# Altium schematic sheet BSPD+SDC.SchDoc (part 3 of 3)
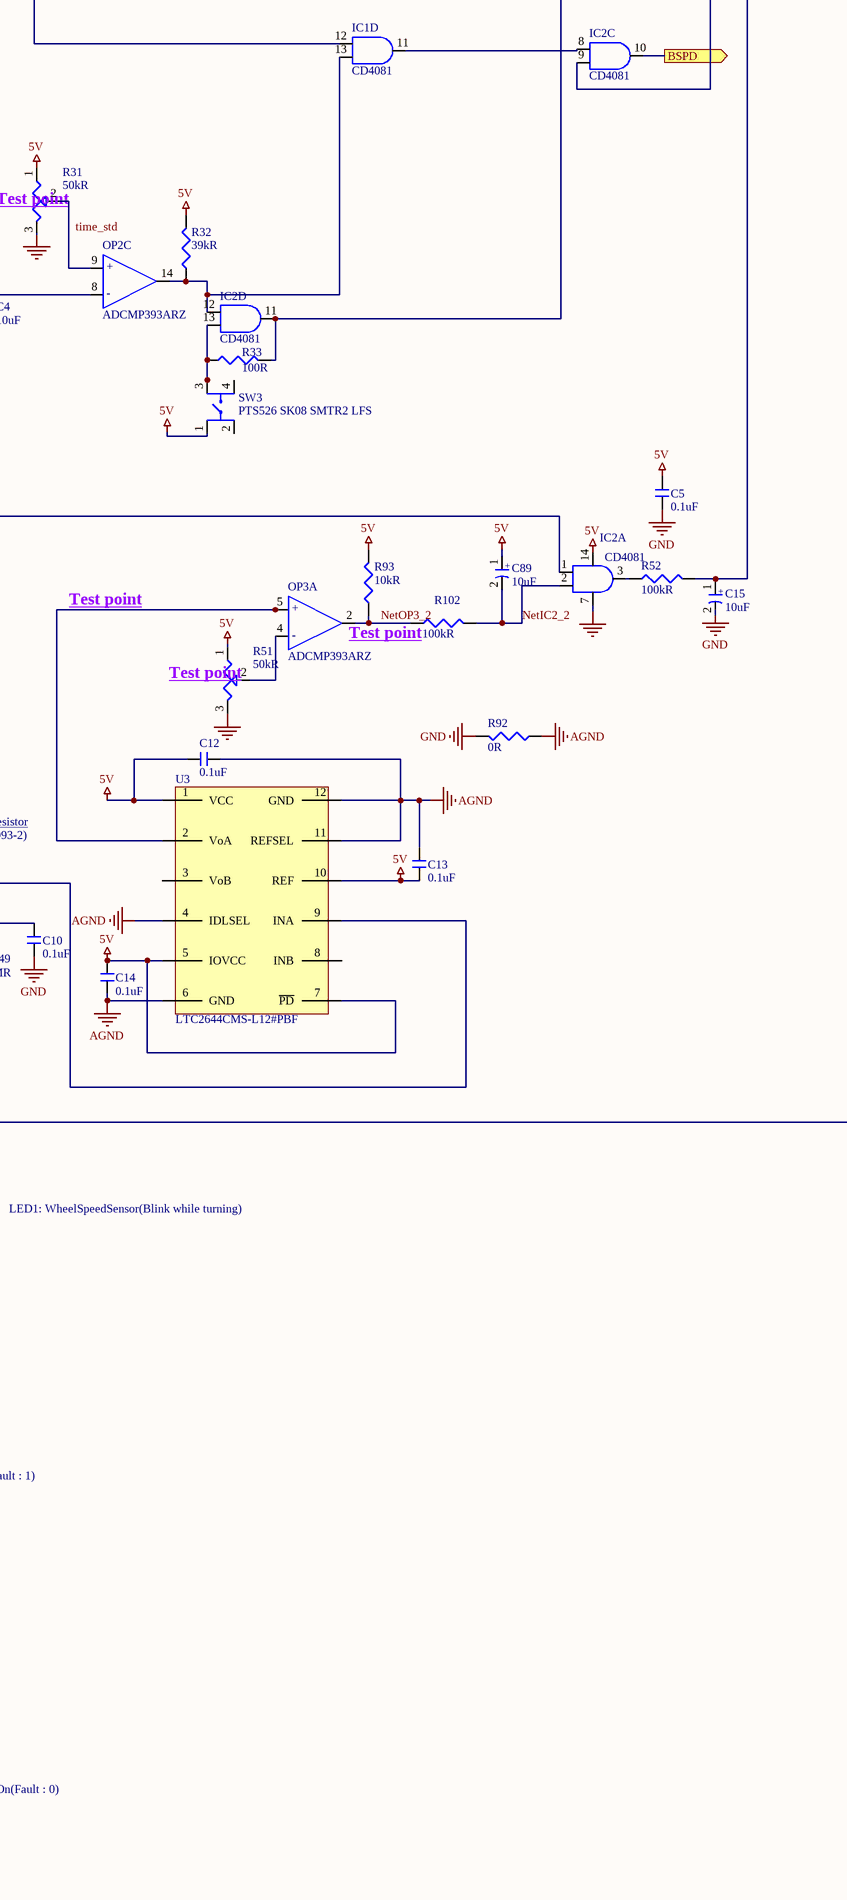
[diagram p5: BSPD+SDC.SchDoc, bottom right]

## Library data of the parts (continued)
OP1-OP4 = ADCMP393ARZ: Comparator Quad R-R I/P 5.5V 14-Pin TSSOP Tube; Manufacturer: Analog Devices; Manufacturer Part Number: ADCMP393ARUZ; Voltage Gain: 132dB; Min Supply Voltage: 2.3V; Number of Elements: 4; Input Offset Voltage (Vos): 500uV; Input Bias Current: 30nA; Quiescent Current: 36.8uA; Propagation Delay: 4.2us; Hysteresis: 4mV; Common Mode Rejection Ratio: 74dB; Power Supply Rejection Ratio (PSRR): 80dB; Supplier 1: Mouser; Supplier Part Number 1: 584-ADCMP393ARZ; Mount: Surface Mount; Case/Package: TSSOP; Number of Pins: 14; Contact Plating: Tin; Min Operating Temperature: -40°C; Max Operating Temperature: 125°C; Packaging: Rail/Tube; Max Supply Voltage: 5.5V; Type: General Purpose; Operating Supply Current: 36.8uA; Lead Free: Contains Lead; RoHS Compliant: Yes; ComponentLink1URL: https://datasheet.ciiva.com/48678/adcmp393-48678181.pdf?src-supplier=Avnet; ComponentLink1Description: https://datasheet.ciiva.com/48678/adcmp393-48678181.pdf?src-supplier=Avnet; ComponentLink2URL: http://datasheet.octopart.com/ADCMP393ARUZ-Analog-Devices-datasheet-27207877.pdf?src-supplier=Analog+Devices; ComponentLink2Description: http://datasheet.octopart.com/ADCMP393ARUZ-Analog-Devices-datasheet-27207877.pdf?src-supplier=Analog+Devices; ComponentLink3URL: http://datasheet.octopart.com/ADCMP393ARUZ-Analog-Devices-datasheet-38899545.pdf?src-supplier=Analog+Devices; ComponentLink3Description: http://datasheet.octopart.com/ADCMP393ARUZ-Analog-Devices-datasheet-38899545.pdf?src-supplier=Analog+Devices; ComponentLink4URL: http://datasheet.octopart.com/ADCMP393ARUZ-Analog-Devices-datasheet-62311843.pdf?src-supplier=Farnell; ComponentLink4Description: http://datasheet.octopart.com/ADCMP393ARUZ-Analog-Devices-datasheet-62311843.pdf?src-supplier=Farnell; ComponentLink5URL: http://datasheet.octopart.com/ADCMP393ARUZ-Analog-Devices-datasheet-78864183.pdf?src-supplier=Farnell; ComponentLink5Description: http://datasheet.octopart.com/ADCMP393ARUZ-Analog-Devices-datasheet-78864183.pdf?src-supplier=Farnell; ComponentLink6URL: http://datasheet.octopart.com/ADCMP393ARUZ-Analog-Devices-datasheet-140566748.pdf?src-supplier=Arrow.cn; ComponentLink6Description: http://datasheet.octopart.com/ADCMP393ARUZ-Analog-Devices-datasheet-140566748.pdf?src-supplier=Arrow.cn; Length: 8.75mm; Width: 4mm; Height: 1.5mm; REACH SVHC: No SVHC; ComponentLink7URL: http://www.mouser.com/ds/2/609/ADCMP391_392_393-878291.pdf?src-supplier=Mouser; ComponentLink7Description: http://www.mouser.com/ds/2/609/ADCMP391_392_393-878291.pdf?src-supplier=Mouser; ComponentLink8URL: http://components.arrow.com/part/dataview/65920778S977637N9143?src-supplier=Arrow+Electronics; ComponentLink8Description: http://components.arrow.com/part/dataview/65920778S977637N9143?src-supplier=Arrow+Electronics; ComponentLink9URL: http://www.analog.com/media/en/technical-documentation/data-sheets/ADCMP393.pdf?src-supplier=Digi-Key; ComponentLink9Description: http://www.analog.com/media/en/technical-documentation/data-sheets/ADCMP393.pdf?src-supplier=Digi-Key; ComponentLink10URL: http://www.farnell.com/datasheets/2042324.pdf?src-supplier=Element14; ComponentLink10Description: http://www.farnell.com/datasheets/2042324.pdf?src-supplier=Element14; ComponentLink11URL: http://www.analog.com/static/imported-files/data_sheets/ADCMP393.pdf?src-supplier=Avnet; ComponentLink11Description: http://www.analog.com/static/imported-files/data_sheets/ADCMP393.pdf?src-supplier=Avnet; ComponentLink12URL: http://datasheet.octopart.com/ADCMP393ARZ-Analog-Devices-datasheet-38899545.pdf?src-supplier=Newark; ComponentLink12Description: http://datasheet.octopart.com/ADCMP393ARZ-Analog-Devices-datasheet-38899545.pdf?src-supplier=Newark; ComponentLink13URL: http://datasheet.octopart.com/ADCMP393ARZ-Analog-Devices-datasheet-27207877.pdf?src-supplier=Farnell; ComponentLink13Description: http://datasheet.octopart.com/ADCMP393ARZ-Analog-Devices-datasheet-27207877.pdf?src-supplier=Farnell; ComponentLink14URL: http://datasheet.octopart.com/ADCMP393ARZ-Analog-Devices-datasheet-32045033.pdf?src-supplier=Newark; ComponentLink14Description: http://datasheet.octopart.com/ADCMP393ARZ-Analog-Devices-datasheet-32045033.pdf?src-supplier=Newark; ComponentLink15URL: http://datasheet.octopart.com/ADCMP393ARZ-Analog-Devices-datasheet-62311843.pdf?src-supplier=Element14; ComponentLink15Description: http://datasheet.octopart.com/ADCMP393ARZ-Analog-Devices-datasheet-62311843.pdf?src-supplier=Element14; ComponentLink16URL: http://datasheet.octopart.com/ADCMP393ARZ-Analog-Devices-datasheet-140566748.pdf?src-supplier=Arrow.cn; ComponentLink16Description: http://datasheet.octopart.com/ADCMP393ARZ-Analog-Devices-datasheet-140566748.pdf?src-supplier=Arrow.cn
R1-R3 R8-R10 = 10k-CRCW080510K0FKEAC: Res Thick Film 0805 10K Ohm 1% 1/8W ±100ppm/°C Molded SMD Paper T/R; Manufacturer: Vishay; Power Rating: 125mW; Resistance: 10000R; Supplier 1: Mouser; Supplier Part Number 1: 71-CRCW080510K0FKEAC; Manufacturer Part Number: CRCW080510K0FKEAC; Stock 1: 593292; Pricing 1: 1 = 0.10000, 10 = 0.05900, 100 = 0.02400, 1000 = 0.01000, 5000 = 0.00700, 10000 = 0.00600, 25000 = 0.00500 (USD); Case/Package: 0805; Tolerance: 1%; Lead Free: Lead Free; ComponentLink1URL: http://www.vishay.com/docs/28773/crcwce3.pdf?src-supplier=Digi-Key; ComponentLink1Description: http://www.vishay.com/docs/28773/crcwce3.pdf?src-supplier=Digi-Key; ComponentLink2URL: http://datasheet.octopart.com/CRCW080510K0FKEAC-Vishay-datasheet-100063072.pdf?src-supplier=Future+Electronics; ComponentLink2Description: http://datasheet.octopart.com/CRCW080510K0FKEAC-Vishay-datasheet-100063072.pdf?src-supplier=Future+Electronics
R4 R5 R11 R12 R22 R27 R31 R37 R51 R55 R62 R69 R76 = 50K可變垂直-3296W-1-503LF: Trimmer; Cermet; Rest 50 Kilohms; PCB; Pwr-Rtg 0.5W; Dim 0.375InLx0.19InWx0.395InH; Manufacturer: Bourns; Tolerance: 10%; Power Rating: 500mW; Number of Turns: 25; Insulation Resistance: 1GR; Temperature Coefficient: 100ppm/°C; Supplier 1: Mouser; Manufacturer Part Number: 3296W-1-503LF; Stock 1: 3535; Pricing 1: 1 = 2.31000, 10 = 1.83000, 50 = 1.76000, 100 = 1.62000, 500 = 1.34000, 1000 = 1.27000, 2000 = 1.09000, 5000 = 1.06000, 10000 = 0.94700 (USD); Mount: Panel; Weight: 0.03oz; Number of Terminals: 3; Color: Blue; Contact Plating: Tin; Min Operating Temperature: -55°C; Max Operating Temperature: 125°C; Resistance: 50kR; Packaging: Rail/Tube; Package Quantity: 50; Composition: Cermet; Termination: Pin; Taper: Linear; Military Standard: Not; Max Power Dissipation: 500mW; Type: Potentiometer; Length: 9.53mm; Height: 0.395inch; Width: 9.53mm; Depth: 4.83mm; Radiation Hardening: No; REACH SVHC: No SVHC; Lead Free: Lead Free; ComponentLink1URL: https://datasheet.ciiva.com/6178/172577-6178371.pdf?src-supplier=Distrelec; ComponentLink1Description: https://datasheet.ciiva.com/6178/172577-6178371.pdf?src-supplier=Distrelec; ComponentLink2URL: https://datasheet.ciiva.com/27747/769485-27747554.pdf?src-supplier=Jameco; ComponentLink2Description: https://datasheet.ciiva.com/27747/769485-27747554.pdf?src-supplier=Jameco; ComponentLink3URL: https://datasheet.ciiva.com/11831/0900766b8069ccf4-11831072.pdf?src-supplier=RSComponents; ComponentLink3Description: https://datasheet.ciiva.com/11831/0900766b8069ccf4-11831072.pdf?src-supplier=RSComponents; ComponentLink4URL: https://datasheet.ciiva.com/29122/447285-da-01-en-trimmer-tht3296w-1-503lf-50k-0-5w-29122369.pdf?src-supplier=Conrad; ComponentLink4Description: https://datasheet.ciiva.com/29122/447285-da-01-en-trimmer-tht3296w-1-503lf-50k-0-5w-29122369.pdf?src-supplier=Conrad; ComponentLink5URL: https://datasheet.ciiva.com/3266/3296-3266197.pdf?src-supplier=Avnet; ComponentLink5Description: https://datasheet.ciiva.com/3266/3296-3266197.pdf?src-supplier=Avnet; ComponentLink6URL: https://datasheet.ciiva.com/2156/3296-2156902.pdf?src-supplier=Digi-Key; ComponentLink6Description: https://datasheet.ciiva.com/2156/3296-2156902.pdf?src-supplier=Digi-Key; ComponentLink7URL: https://datasheet.ciiva.com/25907/3296-25907261.pdf?src-supplier=Avnet+Europe; ComponentLink7Description: https://datasheet.ciiva.com/25907/3296-25907261.pdf?src-supplier=Avnet+Europe; ComponentLink8URL: https://datasheet.ciiva.com/1131/1815117-1131346.pdf?src-supplier=Element14; ComponentLink8Description: https://datasheet.ciiva.com/1131/1815117-1131346.pdf?src-supplier=Element14; ComponentLink9URL: https://datasheet.ciiva.com/20164/68-0300e-20164056.pdf?src-supplier=Rapid+Electronics; ComponentLink9Description: https://datasheet.ciiva.com/20164/68-0300e-20164056.pdf?src-supplier=Rapid+Electronics; ComponentLink10URL: https://datasheet.ciiva.com/30233/3296-30233887.pdf?src-supplier=Onlinecomponents.com; ComponentLink10Description: https://datasheet.ciiva.com/30233/3296-30233887.pdf?src-supplier=Onlinecomponents.com; ComponentLink11URL: http://datasheet.octopart.com/3296W-1-503LF-Bourns-datasheet-9257.pdf?src-supplier=Factory+Futures; ComponentLink11Description: http://datasheet.octopart.com/3296W-1-503LF-Bourns-datasheet-9257.pdf?src-supplier=Factory+Futures; ComponentLink12URL: http://datasheet.octopart.com/3296W-1-503LF-Bourns-datasheet-8754025.pdf?src-supplier=Electro+Sonic; ComponentLink12Description: http://datasheet.octopart.com/3296W-1-503LF-Bourns-datasheet-8754025.pdf?src-supplier=Electro+Sonic; ComponentLink13URL: http://datasheet.octopart.com/3296W-1-503LF-Bourns-datasheet-62345832.pdf?src-supplier=Element14; ComponentLink13Description: http://datasheet.octopart.com/3296W-1-503LF-Bourns-datasheet-62345832.pdf?src-supplier=Element14; ComponentLink14URL: http://datasheet.octopart.com/3296W-1-503LF-Bourns-datasheet-8458046.pdf?src-supplier=Factory+Futures; ComponentLink14Description: http://datasheet.octopart.com/3296W-1-503LF-Bourns-datasheet-8458046.pdf?src-supplier=Factory+Futures; ComponentLink15URL: http://datasheet.octopart.com/3296W-1-503LF-Bourns-datasheet-8359740.pdf?src-supplier=_legacy+Avnet; ComponentLink15Description: http://datasheet.octopart.com/3296W-1-503LF-Bourns-datasheet-8359740.pdf?src-supplier=_legacy+Avnet; ComponentLink16URL: http://datasheet.octopart.com/3296W-1-503LF-Bourns-datasheet-25360155.pdf?src-supplier=Allied+Electronics; ComponentLink16Description: http://datasheet.octopart.com/3296W-1-503LF-Bourns-datasheet-25360155.pdf?src-supplier=Allied+Electronics; ComponentLink17URL: http://datasheet.octopart.com/3296W-1-503LF-Bourns-datasheet-47378.pdf?src-supplier=Allied+Electronics; ComponentLink17Description: http://datasheet.octopart.com/3296W-1-503LF-Bourns-datasheet-47378.pdf?src-supplier=Allied+Electronics; ComponentLink18URL: http://datasheet.octopart.com/3296W-1-503LF-Bourns-datasheet-528316.pdf?src-supplier=Farnell; ComponentLink18Description: http://datasheet.octopart.com/3296W-1-503LF-Bourns-datasheet-528316.pdf?src-supplier=Farnell; ComponentLink19URL: http://datasheet.octopart.com/3296W-1-503LF-Bourns-datasheet-6152.pdf?src-supplier=Farnell; ComponentLink19Description: http://datasheet.octopart.com/3296W-1-503LF-Bourns-datasheet-6152.pdf?src-supplier=Farnell; ComponentLink20URL: http://datasheet.octopart.com/3296W-1-503LF.-Bourns-datasheet-7284159.pdf?src-supplier=Jameco; ComponentLink20Description: http://datasheet.octopart.com/3296W-1-503LF.-Bourns-datasheet-7284159.pdf?src-supplier=Jameco; ComponentLink21URL: http://datasheet.octopart.com/3296W-1-503LF-Bourns-datasheet-14175298.pdf?src-supplier=IIIC; ComponentLink21Description: http://datasheet.octopart.com/3296W-1-503LF-Bourns-datasheet-14175298.pdf?src-supplier=IIIC; ComponentLink22URL: http://datasheet.octopart.com/3296W-1-503LF-Bourns-datasheet-17840116.pdf?src-supplier=Jameco; ComponentLink22Description: http://datasheet.octopart.com/3296W-1-503LF-Bourns-datasheet-17840116.pdf?src-supplier=Jameco; Supplier Part Number 1: 652-3296W-1-503LF
R6 R13 R15 R17 R34 R89 R101 = 470-CRCW0805470RFKEAC: Res Thick Film 0805 470 Ohm 1% 1/8W ±100ppm/°C Molded SMD Paper T/R; Manufacturer: Vishay; Power Rating: 125mW; Supplier 1: Mouser; Supplier Part Number 1: 71-CRCW0805470RFKEAC; Manufacturer Part Number: CRCW0805470RFKEAC; Stock 1: 31729; Pricing 1: 1 = 0.10000, 10 = 0.05900, 100 = 0.02400, 1000 = 0.01000, 5000 = 0.00700, 10000 = 0.00600 (USD); Case/Package: 0805; Resistance: 470R; Tolerance: 1%; Lead Free: Lead Free; ComponentLink1URL: http://www.vishay.com/docs/28773/crcwce3.pdf?src-supplier=Digi-Key; ComponentLink1Description: http://www.vishay.com/docs/28773/crcwce3.pdf?src-supplier=Digi-Key
R7 R14 R21 R23 R25 R29 R32 R38 R48-R50 R92-R94 = 39k-CRCW080539K0FKEAC: CRCW Thick Film Commodity Chip Resistor 0805 Size 39K Ohm 1% 0.125 W 100 ppm/K 2-Pin SMD Paper T/R; Manufacturer: Vishay; Supplier 1: Mouser; Supplier Part Number 1: 71-CRCW080539K0FKEAC; Manufacturer Part Number: CRCW080539K0FKEAC; Stock 1: 13079; Pricing 1: 1 = 0.16000, 10 = 0.05900, 100 = 0.02400, 1000 = 0.01000, 5000 = 0.00700, 10000 = 0.00600, 25000 = 0.00500 (USD)
R16 R18 = 100-CRCW0805100RFKEAC: Res Thick Film 0805 100 Ohm 1% 1/8W ±100ppm/°C Molded SMD Paper T/R; Manufacturer: Vishay; Power Rating: 125mW; Resistance: 100R; Supplier 1: Mouser; Supplier Part Number 1: 71-CRCW0805100RFKEAC; Manufacturer Part Number: CRCW0805100RFKEAC; Stock 1: 249348; Pricing 1: 1 = 0.10000, 10 = 0.05900, 100 = 0.02400, 1000 = 0.01000, 5000 = 0.00700, 10000 = 0.00600, 25000 = 0.00500 (USD); Case/Package: 0805; Tolerance: 1%; Lead Free: Lead Free; ComponentLink1URL: http://www.vishay.com/docs/28773/crcwce3.pdf?src-supplier=Digi-Key; ComponentLink1Description: http://www.vishay.com/docs/28773/crcwce3.pdf?src-supplier=Digi-Key; ComponentLink2URL: http://datasheet.octopart.com/CRCW0805100RFKEAC-Vishay-datasheet-100063072.pdf?src-supplier=Future+Electronics; ComponentLink2Description: http://datasheet.octopart.com/CRCW0805100RFKEAC-Vishay-datasheet-100063072.pdf?src-supplier=Future+Electronics
R19 R30 R52 R65 R72 R79 R102 = 100k-CRCW0805100KFKEAC: Res Thick Film 0805 100K Ohm 1% 1/8W ±100ppm/°C Molded SMD Paper T/R; Manufacturer: Vishay; Power Rating: 125mW; Supplier 1: Mouser; Supplier Part Number 1: 71-CRCW0805100KFKEAC; Manufacturer Part Number: CRCW0805100KFKEAC; Stock 1: 206602; Pricing 1: 1 = 0.10000, 10 = 0.05900, 100 = 0.02400, 1000 = 0.01000, 5000 = 0.00700, 10000 = 0.00600, 25000 = 0.00500 (USD); Mount: Surface Mount; Case/Package: Molded; Contact Plating: Tin; Min Operating Temperature: -55°C; Max Operating Temperature: 155°C; Composition: Thick Film; Termination: Wraparound; Temperature Coefficient: 100ppm/°C; Resistance: 100kR; Tolerance: 1%; Length: 2mm; Lead Free: Lead Free; ComponentLink1URL: http://www.vishay.com/docs/20035/dcrcwe3.pdf?src-supplier=Avnet+Asia; ComponentLink1Description: http://www.vishay.com/docs/20035/dcrcwe3.pdf?src-supplier=Avnet+Asia; ComponentLink2URL: http://www.vishay.com/docs/28773/crcwce3.pdf?src-supplier=Digi-Key; ComponentLink2Description: http://www.vishay.com/docs/28773/crcwce3.pdf?src-supplier=Digi-Key; ComponentLink3URL: http://datasheet.octopart.com/CRCW0805100KFKEAC-Vishay-datasheet-100063072.pdf?src-supplier=Future+Electronics; ComponentLink3Description: http://datasheet.octopart.com/CRCW0805100KFKEAC-Vishay-datasheet-100063072.pdf?src-supplier=Future+Electronics
R20 R24 R33 = 100-CRCW0805100RFKEAC: Res Thick Film 0805 100 Ohm 1% 1/8W ±100ppm/°C Molded SMD Paper T/R; Manufacturer: Vishay; Power Rating: 125mW; Supplier 1: Mouser; Supplier Part Number 1: 71-CRCW0805100RFKEAC; Manufacturer Part Number: CRCW0805100RFKEAC; Stock 1: 249348; Pricing 1: 1 = 0.10000, 10 = 0.05900, 100 = 0.02400, 1000 = 0.01000, 5000 = 0.00700, 10000 = 0.00600, 25000 = 0.00500 (USD); Case/Package: 0805; Resistance: 100R; Tolerance: 1%; Lead Free: Lead Free; ComponentLink1URL: http://www.vishay.com/docs/28773/crcwce3.pdf?src-supplier=Digi-Key; ComponentLink1Description: http://www.vishay.com/docs/28773/crcwce3.pdf?src-supplier=Digi-Key; ComponentLink2URL: http://datasheet.octopart.com/CRCW0805100RFKEAC-Vishay-datasheet-100063072.pdf?src-supplier=Future+Electronics; ComponentLink2Description: http://datasheet.octopart.com/CRCW0805100RFKEAC-Vishay-datasheet-100063072.pdf?src-supplier=Future+Electronics
R26 R35 = RT0805FRE102KL: High Precision-High Stability Chip Resistor Thin Film 0805 2kOhm 1% Paper T/R; Manufacturer: Yageo; catagory: resister; Supplier 1: Mouser; Supplier Part Number 1: 603-RT0805FRE102KL; Manufacturer Part Number: RT0805FRE102KL; Stock 1: 14347; Pricing 1: 1 = 0.12000, 10 = 0.06400, 100 = 0.02300, 1000 = 0.01600, 2500 = 0.01100, 10000 = 0.01000 (USD); Case/Package: 0805; Resistance: 2kR; Tolerance: 1%; ComponentLink1URL: http://datasheet.octopart.com/RT0805FRE102KL-Yageo-datasheet-86813807.pdf; ComponentLink1Description: http://datasheet.octopart.com/RT0805FRE102KL-Yageo-datasheet-86813807.pdf
R28 R36 = RT0805FRE1310KL: Res Thin Film 0805 10K Ohm 1% 0.125W(1/8W) ±50ppm/C Molded SMD Paper T/R; Manufacturer: Yageo; Resistance: 10kR; catagory: resister; Supplier 1: Mouser; Supplier Part Number 1: 603-RT0805FRE1310KL; Manufacturer Part Number: RT0805FRE1310KL; RoHS: No; Stock 1: 7132; Pricing 1: 1 = 0.12000, 10 = 0.06400, 100 = 0.02300, 1000 = 0.01600, 2500 = 0.01100, 10000 = 0.01000 (USD); Case/Package: 0805; Min Operating Temperature: -55°C; Max Operating Temperature: 125°C; Packaging: Tape and Reel; Tolerance: 1%; Composition: Thin Film; Military Standard: Not; Length: 2mm; Depth: 1.25mm; ComponentLink1URL: http://components.arrow.com/part/dataview/0323_03828670?src-supplier=Arrow+Europe; ComponentLink1Description: http://components.arrow.com/part/dataview/0323_03828670?src-supplier=Arrow+Europe
R39 = RT0805DRE07115RL: High Precision-High Stability Chip Resistor Thin Film 0805 115Ohm 0.5% Paper T/R; Manufacturer: Yageo; Max Power Dissipation: 125mW; Temperature Coefficient: 50ppm/°C; Voltage Rating (DC): 150V; catagory: resister; Supplier 1: Mouser; Supplier Part Number 1: 603-RT0805DRE07115RL; Manufacturer Part Number: RT0805DRE07115RL; Stock 1: 9900; Pricing 1: 1 = 0.17000, 10 = 0.08800, 100 = 0.03100, 1000 = 0.02200, 5000 = 0.01500, 10000 = 0.01400 (USD); Case/Package: 0805; Case Code (Metric): 2012; Case Code (Imperial): 0805; Min Operating Temperature: -55°C; Max Operating Temperature: 155°C; Package Quantity: 5000; Packaging: Tape and Reel; Resistance: 115R; Tolerance: 0.5%; Composition: Thin Film; Number of Terminations: 2; Features: Moisture Resistant; Length: 0.079inch; Height: 0.024inch; Width: 0.049inch; Lead Free: Lead Free; ComponentLink1URL: https://datasheet.ciiva.com/2569/pyu-rt-1-to-0-05-rohs-l-5-2569178.pdf?src-supplier=Digi-Key; ComponentLink1Description: https://datasheet.ciiva.com/2569/pyu-rt-1-to-0-05-rohs-l-5-2569178.pdf?src-supplier=Digi-Key; ComponentLink2URL: http://datasheet.octopart.com/RT0805DRE07115RL-Yageo-datasheet-86813807.pdf; ComponentLink2Description: http://datasheet.octopart.com/RT0805DRE07115RL-Yageo-datasheet-86813807.pdf
R40 = 0805 4.7KΩ (4701) 1%: 贴片电阻; ComponentLink1Description: 供应商链接; ComponentLink1URL: http://www.szlcsc.com/product/details_18361.html; Package: 0805; Supplier: LC; SuppliersPartNumber: C17673
R41 R43 = 0805 10KΩ (1002) 1%: 贴片电阻; ComponentLink1Description: 供应商链接; ComponentLink1URL: http://www.szlcsc.com/product/details_18102.html; Package: 0805; Supplier: LC; SuppliersPartNumber: C17414
R42 = 0805 39KΩ (3902) 1%: 贴片电阻; ComponentLink1Description: 供应商链接; ComponentLink1URL: http://www.szlcsc.com/product/details_26569.html; Package: 0805; Supplier: LC; SuppliersPartNumber: C25826
R44 = 0805 2.2KΩ (2201) 1%: 贴片电阻; ComponentLink1Description: 供应商链接; ComponentLink1URL: http://www.szlcsc.com/product/details_18208.html; Package: 0805; Supplier: LC; SuppliersPartNumber: C17520
R45 = 0805 470KΩ (4703) 1%: 贴片电阻; ComponentLink1Description: 供应商链接; ComponentLink1URL: http://www.szlcsc.com/product/details_18397.html; Package: 0805; Supplier: LC; SuppliersPartNumber: C17709
R46 R47 = 0805 47KΩ (4702) 1%: 贴片电阻; ComponentLink1Description: 供应商链接; ComponentLink1URL: http://www.szlcsc.com/product/details_18401.html; Package: 0805; Supplier: LC; SuppliersPartNumber: C17713
R53 R54 R56-R58 R83-R88 R90 R91 = 470-CRCW0805470RFKEAC: Res Thick Film 0805 470 Ohm 1% 1/8W ±100ppm/°C Molded SMD Paper T/R; Manufacturer: Vishay; Power Rating: 125mW; Resistance: 470R; Supplier 1: Mouser; Supplier Part Number 1: 71-CRCW0805470RFKEAC; Manufacturer Part Number: CRCW0805470RFKEAC; Stock 1: 31729; Pricing 1: 1 = 0.10000, 10 = 0.05900, 100 = 0.02400, 1000 = 0.01000, 5000 = 0.00700, 10000 = 0.00600 (USD); Case/Package: 0805; Tolerance: 1%; Lead Free: Lead Free; ComponentLink1URL: http://www.vishay.com/docs/28773/crcwce3.pdf?src-supplier=Digi-Key; ComponentLink1Description: http://www.vishay.com/docs/28773/crcwce3.pdf?src-supplier=Digi-Key
R59 R66 R73 = RT0805FRE07432RL: Res Thin Film 0805 432 Ohm 1% 1/8W ±50ppm/°C Molded SMD SMD Paper T/R; Manufacturer: Yageo; Power Rating: 125mW; Voltage Rating: 150V; catagory: resister; Supplier 1: Mouser; Supplier Part Number 1: 603-RT0805FRE07432RL; Manufacturer Part Number: RT0805FRE07432RL; Stock 1: 2636; Pricing 1: 1 = 0.12000, 10 = 0.06400, 100 = 0.02300, 1000 = 0.01600, 5000 = 0.01100, 10000 = 0.01000 (USD); Case/Package: 0805; Case Code (Metric): 2012; Case Code (Imperial): 0805; Contact Plating: Tin; Min Operating Temperature: -55°C; Max Operating Temperature: 125°C; Resistance: 432R; Tolerance: 1%; Packaging: Tape and Reel; Composition: Thin Film; Termination: SMD/SMT; Temperature Coefficient: 50ppm/°C; Voltage Rating (DC): 150V; Length: 2mm; Height: 500um; Width: 1.25mm; Radiation Hardening: No; Lead Free: Lead Free; ComponentLink1URL: https://datasheet.ciiva.com/12703/pyu-rt-1-to-0-05-rohs-l-4-12703656.pdf?src-supplier=Mouser; ComponentLink1Description: https://datasheet.ciiva.com/12703/pyu-rt-1-to-0-05-rohs-l-4-12703656.pdf?src-supplier=Mouser; ComponentLink2URL: http://datasheet.octopart.com/RT0805FRE07432RL-Yageo-datasheet-86813807.pdf; ComponentLink2Description: http://datasheet.octopart.com/RT0805FRE07432RL-Yageo-datasheet-86813807.pdf
R60 R67 R74 = RT0805DRE074K99L: Res Thin Film 0805 4.99K Ohm 0.5% 1/8W ±50ppm/°C Molded SMD Paper T/R; Manufacturer: Yageo; Max Power Dissipation: 125mW; Voltage Rating (DC): 150V; catagory: resister; Supplier 1: Mouser; Supplier Part Number 1: 603-RT0805DRE074K99L; Manufacturer Part Number: RT0805DRE074K99L; Stock 1: 12154; Pricing 1: 1 = 0.17000, 10 = 0.08800, 100 = 0.03100, 1000 = 0.02200, 5000 = 0.01500, 10000 = 0.01400 (USD); Case/Package: 0805; Case Code (Metric): 2012; Case Code (Imperial): 0805; Min Operating Temperature: -55°C; Max Operating Temperature: 155°C; Resistance: 4.99kR; Tolerance: 0.5%; Packaging: Tape and Reel; Package Quantity: 5000; Composition: Thin Film; Number of Terminations: 2; Military Standard: Not; Temperature Coefficient: 50ppm/°C; Features: Moisture Resistant; Length: 0.079inch; Height: 0.024inch; Width: 0.049inch; Depth: 1.25mm; Lead Free: Lead Free; ComponentLink1URL: https://datasheet.ciiva.com/2569/pyu-rt-1-to-0-05-rohs-l-5-2569530.pdf?src-supplier=Digi-Key; ComponentLink1Description: https://datasheet.ciiva.com/2569/pyu-rt-1-to-0-05-rohs-l-5-2569530.pdf?src-supplier=Digi-Key; ComponentLink2URL: http://datasheet.octopart.com/RT0805DRE074K99L-Yageo-datasheet-86813807.pdf; ComponentLink2Description: http://datasheet.octopart.com/RT0805DRE074K99L-Yageo-datasheet-86813807.pdf
R61 R68 R75 = RT0805DRE0711KL: Res High Precision Thin Film 0805 11k Ohm 0.5% 1/8W ±50ppm/°C Molded Paper T/R; Manufacturer: Yageo; Resistance: 11kR; Max Power Dissipation: 125mW; Voltage Rating (DC): 150V; catagory: resister; Supplier 1: Mouser; Supplier Part Number 1: 603-RT0805DRE0711KL; Manufacturer Part Number: RT0805DRE0711KL; Stock 1: 6290; Pricing 1: 1 = 0.17000, 10 = 0.08800, 100 = 0.03100, 1000 = 0.02200, 5000 = 0.01500, 10000 = 0.01400 (USD); Case/Package: 0805; Case Code (Metric): 2012; Case Code (Imperial): 0805; Min Operating Temperature: -55°C; Max Operating Temperature: 155°C; Package Quantity: 5000; Packaging: Tape and Reel; Tolerance: 0.5%; Composition: Thin Film; Number of Terminations: 2; Temperature Coefficient: 50ppm/°C; Features: Moisture Resistant; Length: 0.079inch; Height: 0.024inch; Width: 0.049inch; Lead Free: Lead Free; ComponentLink1URL: https://datasheet.ciiva.com/2569/pyu-rt-1-to-0-05-rohs-l-5-2569184.pdf?src-supplier=Digi-Key; ComponentLink1Description: https://datasheet.ciiva.com/2569/pyu-rt-1-to-0-05-rohs-l-5-2569184.pdf?src-supplier=Digi-Key; ComponentLink2URL: http://datasheet.octopart.com/RT0805DRE0711KL-Yageo-datasheet-86813807.pdf; ComponentLink2Description: http://datasheet.octopart.com/RT0805DRE0711KL-Yageo-datasheet-86813807.pdf
R63 R64 R70 R71 R77 R78 R95-R100 = 100k-CRCW0805100KFKEAC: Res Thick Film 0805 100K Ohm 1% 1/8W ±100ppm/°C Molded SMD Paper T/R; Manufacturer: Vishay; Power Rating: 125mW; Resistance: 100kR; Supplier 1: Mouser; Supplier Part Number 1: 71-CRCW0805100KFKEAC; Manufacturer Part Number: CRCW0805100KFKEAC; Stock 1: 206602; Pricing 1: 1 = 0.10000, 10 = 0.05900, 100 = 0.02400, 1000 = 0.01000, 5000 = 0.00700, 10000 = 0.00600, 25000 = 0.00500 (USD); Mount: Surface Mount; Case/Package: Molded; Contact Plating: Tin; Min Operating Temperature: -55°C; Max Operating Temperature: 155°C; Composition: Thick Film; Termination: Wraparound; Temperature Coefficient: 100ppm/°C; Tolerance: 1%; Length: 2mm; Lead Free: Lead Free; ComponentLink1URL: http://www.vishay.com/docs/20035/dcrcwe3.pdf?src-supplier=Avnet+Asia; ComponentLink1Description: http://www.vishay.com/docs/20035/dcrcwe3.pdf?src-supplier=Avnet+Asia; ComponentLink2URL: http://www.vishay.com/docs/28773/crcwce3.pdf?src-supplier=Digi-Key; ComponentLink2Description: http://www.vishay.com/docs/28773/crcwce3.pdf?src-supplier=Digi-Key; ComponentLink3URL: http://datasheet.octopart.com/CRCW0805100KFKEAC-Vishay-datasheet-100063072.pdf?src-supplier=Future+Electronics; ComponentLink3Description: http://datasheet.octopart.com/CRCW0805100KFKEAC-Vishay-datasheet-100063072.pdf?src-supplier=Future+Electronics
R80-R82 = RP73PF2A665RBTDF: Res Thin Film 0805 665 Ohm 0.1% 1/8W ±25ppm/°C Molded SMD Paper T/R; Manufacturer: TE Connectivity; Power Rating: 250mW; Voltage Rating: 150V; catagory: resister; Supplier 1: Mouser; Supplier Part Number 1: 279-RP73PF2A665RBTDF; Manufacturer Part Number: RP73PF2A665RBTDF; Stock 1: 1934; Pricing 1: 1 = 0.36000, 10 = 0.33400, 100 = 0.25600, 500 = 0.22300, 1000 = 0.18400, 2000 = 0.16800 (USD); Case/Package: 0805; Case Code (Metric): 2012; Case Code (Imperial): 0805; Min Operating Temperature: -55°C; Max Operating Temperature: 155°C; Resistance: 665R; Tolerance: 0.1%; Packaging: Cut Tape; Composition: Thin Film; Termination: Flat; Temperature Coefficient: 25ppm/°C; Voltage Rating (DC): 150V; Length: 2mm; Height: 0.55mm; Depth: 1.25mm; REACH SVHC: No SVHC; ComponentLink1URL: https://datasheet.ciiva.com/46393/1635325-46393238.pdf?src-supplier=Element14; ComponentLink1Description: https://datasheet.ciiva.com/46393/1635325-46393238.pdf?src-supplier=Element14; ComponentLink2URL: https://datasheet.ciiva.com/7863/1635325-7863032.pdf?src-supplier=Element14; ComponentLink2Description: https://datasheet.ciiva.com/7863/1635325-7863032.pdf?src-supplier=Element14; ComponentLink3URL: http://datasheet.octopart.com/2176092-2-TE-Connectivity-datasheet-97102182.pdf?src-supplier=TE+Connectivity; ComponentLink3Description: http://datasheet.octopart.com/2176092-2-TE-Connectivity-datasheet-97102182.pdf?src-supplier=TE+Connectivity; ComponentLink4URL: http://datasheet.octopart.com/RP73PF2A665RBTDF-TE-Connectivity-datasheet-11516962.pdf?src-supplier=Element14; ComponentLink4Description: http://datasheet.octopart.com/RP73PF2A665RBTDF-TE-Connectivity-datasheet-11516962.pdf?src-supplier=Element14; ComponentLink5URL: http://datasheet.octopart.com/RP73PF2A665RBTDF-Tyco-Electronics-datasheet-11120217.pdf?src-supplier=Farnell; ComponentLink5Description: http://datasheet.octopart.com/RP73PF2A665RBTDF-Tyco-Electronics-datasheet-11120217.pdf?src-supplier=Farnell
re1-re3 = G2RL-2A4-DC12: Power Relay 12VDC 8A DPST-NO( (29mm 12.7mm 15.7mm)) THT; Manufacturer: Omron; Max Voltage Rating (AC): 440V; Max Voltage Rating (DC): 300V; Throw Configuration: DPST; Coil Resistance: 360R; Coil Current: 33.3mA; Coil Voltage (DC): 12V; Power Consumption: 400mW; Operate Time: 15ms; Coil Type: Non-Latching; Relay Type: General Purpose; Release Time: 5ms; Supplier 1: Mouser; Supplier Part Number 1: 653-G2RL-2A4-DC12; Manufacturer Part Number: G2RL-2A4-DC12; Stock 1: 117; Pricing 1: 1 = 4.17000, 25 = 3.46000, 50 = 3.30000, 100 = 3.13000, 200 = 2.82000, 500 = 2.82000 (USD); Mount: Through Hole; Case/Package: DIP; Number of Pins: 6; Weight: 12g; Contact Material: Silver; Min Operating Temperature: -40°C; Max Operating Temperature: 85°C; Packaging: Bulk; Max Current Rating: 8A; Package Quantity: 20; Contact Current Rating: 8A; Termination: PC Pin; Coil Power: 400mW; Length: 29mm; Height: 15.7mm; Width: 12.7mm; Radiation Hardening: No; ComponentLink1URL: https://datasheet.ciiva.com/43511/en-g2rl-43511039.pdf?src-supplier=Onlinecomponents.com; ComponentLink1Description: https://datasheet.ciiva.com/43511/en-g2rl-43511039.pdf?src-supplier=Onlinecomponents.com; ComponentLink2URL: https://datasheet.ciiva.com/5236/g2rl-0911-5236343.pdf?src-supplier=Mouser; ComponentLink2Description: https://datasheet.ciiva.com/5236/g2rl-0911-5236343.pdf?src-supplier=Mouser; ComponentLink3URL: https://datasheet.ciiva.com/8687/g2rl-0911-8687997.pdf?src-supplier=Avnet; ComponentLink3Description: https://datasheet.ciiva.com/8687/g2rl-0911-8687997.pdf?src-supplier=Avnet; ComponentLink4URL: http://datasheet.octopart.com/G2RL-2A4-DC12-Omron-datasheet-10910117.pdf?src-supplier=Electro+Sonic; ComponentLink4Description: http://datasheet.octopart.com/G2RL-2A4-DC12-Omron-datasheet-10910117.pdf?src-supplier=Electro+Sonic; ComponentLink5URL: http://datasheet.octopart.com/G2RL-2A4-DC12-Omron-datasheet-16972895.pdf?src-supplier=Sager+Electronics; ComponentLink5Description: http://datasheet.octopart.com/G2RL-2A4-DC12-Omron-datasheet-16972895.pdf?src-supplier=Sager+Electronics; catagory: relay
SW1-SW3 = PTS526 SK08 SMTR2 LFS: Switch Tactile N.O. SPST Flush Round Button Gull Wing 0.05A 12VDC 200000Cycles 2.45N SMD T/R; Manufacturer: C&K Components; Supplier 1: Digi-Key; Manufacturer Part Number: PTS526 SK08 SMTR2 LFS; Stock 1: 4182; Pricing 1: 1 = 0.12000, 10 = 0.11200, 25 = 0.10600, 100 = 0.09630, 250 = 0.09052, 500 = 0.08282, 1000 = 0.06934, 2500 = 0.06741 (USD); ComponentLink1URL: http://datasheet.octopart.com/PTS526SK08SMTR2LFS-C%26K-Components-datasheet-138817219.pdf?src-supplier=Future+Electronics; ComponentLink1Description: http://datasheet.octopart.com/PTS526SK08SMTR2LFS-C%26K-Components-datasheet-138817219.pdf?src-supplier=Future+Electronics; Supplier Part Number 1: CKN12219-1-ND
U1 = CD4041UBM96: Buffer 4-CH Inverting/Non-Inverting Push-Pull CMOS 14-Pin SOIC-14 Tube; Manufacturer: Texas Instruments; Manufacturer Part Number: CD4041UBPW; Max Supply Voltage: 18V; Min Supply Voltage: 3V; Propagation Delay: 50ns; Number of Elements: 4; Low Level Output Current: 24mA; Number of Output Lines: 8; Number of Bits per Element: 1; High Level Output Current: -24mA; Quiescent Current: 20uA; Turn-On Delay Time: 120ns; Max Power Dissipation: 100mW; Supplier 1: Mouser; Supplier Part Number 1: 595-CD4041UBM96G4; Mount: Surface Mount; Case/Package: TSSOP; Number of Pins: 14; Contact Plating: Gold; Min Operating Temperature: -55°C; Max Operating Temperature: 125°C; Packaging: Rail/Tube; Logic Function: Buffer; Package Quantity: 90; Number of Channels: 4; Number of Inputs: 4; Number of Outputs: 4; Number of Input Lines: 4; Polarity: Non-Inverting; Number of Bits: 4; Termination: SMD/SMT; Lead Free: Lead Free; REACH SVHC: No SVHC; ComponentLink1URL: https://datasheet.ciiva.com/1506/1762971-1506275.pdf?src-supplier=Element14; ComponentLink1Description: https://datasheet.ciiva.com/1506/1762971-1506275.pdf?src-supplier=Element14; ComponentLink2URL: https://datasheet.ciiva.com/46618/1836516-46618790.pdf?src-supplier=Newark; ComponentLink2Description: https://datasheet.ciiva.com/46618/1836516-46618790.pdf?src-supplier=Newark; ComponentLink3URL: https://datasheet.ciiva.com/1842/cd4041ub-1842824.pdf?src-supplier=Digi-Key; ComponentLink3Description: https://datasheet.ciiva.com/1842/cd4041ub-1842824.pdf?src-supplier=Digi-Key; ComponentLink4URL: https://octopart.com/click/track?ai=10049&ct=datasheets&sig=04d6427&at=physicalpart&sid=370&ppid=7097409&hlid=29930956&src-supplier=TI+store; ComponentLink4Description: https://octopart.com/click/track?ai=10049&ct=datasheets&sig=04d6427&at=physicalpart&sid=370&ppid=7097409&hlid=29930956&src-supplier=TI+store; ComponentLink5URL: http://datasheet.octopart.com/CD4041UBPW-Texas-Instruments-datasheet-10255163.pdf?src-supplier=Arrow+Electronics; ComponentLink5Description: http://datasheet.octopart.com/CD4041UBPW-Texas-Instruments-datasheet-10255163.pdf?src-supplier=Arrow+Electronics; ComponentLink6URL: http://datasheet.octopart.com/CD4041UBPW-Texas-Instruments-datasheet-27908145.pdf?src-supplier=TI+store; ComponentLink6Description: http://datasheet.octopart.com/CD4041UBPW-Texas-Instruments-datasheet-27908145.pdf?src-supplier=TI+store; ComponentLink7URL: http://datasheet.octopart.com/CD4041UBPW-Texas-Instruments-datasheet-149741.pdf?src-supplier=TI+store; ComponentLink7Description: http://datasheet.octopart.com/CD4041UBPW-Texas-Instruments-datasheet-149741.pdf?src-supplier=TI+store; ComponentLink8URL: http://datasheet.octopart.com/CD4041UBPW-Texas-Instruments-datasheet-10253518.pdf?src-supplier=TI+store; ComponentLink8Description: http://datasheet.octopart.com/CD4041UBPW-Texas-Instruments-datasheet-10253518.pdf?src-supplier=TI+store; ComponentLink9URL: http://sigma.octopart.com/49249819/technical_drawing/Texas-Instruments-CD4041UBPW.pdf?src-supplier=TI+store; ComponentLink9Description: http://sigma.octopart.com/49249819/technical_drawing/Texas-Instruments-CD4041UBPW.pdf?src-supplier=TI+store; ComponentLink10URL: http://datasheet.octopart.com/CD4041UBPW-Texas-Instruments-datasheet-8377696.pdf?src-supplier=Newark; ComponentLink10Description: http://datasheet.octopart.com/CD4041UBPW-Texas-Instruments-datasheet-8377696.pdf?src-supplier=Newark; ComponentLink11URL: http://datasheet.octopart.com/CD4041UBPW-Texas-Instruments-datasheet-654559.pdf?src-supplier=Newark; ComponentLink11Description: http://datasheet.octopart.com/CD4041UBPW-Texas-Instruments-datasheet-654559.pdf?src-supplier=Newark; ComponentLink12URL: http://datasheet.octopart.com/CD4041UBPW-Texas-Instruments-datasheet-8816533.pdf?src-supplier=Newark; ComponentLink12Description: http://datasheet.octopart.com/CD4041UBPW-Texas-Instruments-datasheet-8816533.pdf?src-supplier=Newark; ComponentLink13URL: http://datasheet.octopart.com/CD4041UBPW-Texas-Instruments-datasheet-11538150.pdf?src-supplier=Element14; ComponentLink13Description: http://datasheet.octopart.com/CD4041UBPW-Texas-Instruments-datasheet-11538150.pdf?src-supplier=Element14; ComponentLink14URL: http://datasheet.octopart.com/CD4041UBPW-Texas-Instruments-datasheet-21076600.pdf?src-supplier=Element14; ComponentLink14Description: http://datasheet.octopart.com/CD4041UBPW-Texas-Instruments-datasheet-21076600.pdf?src-supplier=Element14; ComponentLink15URL: http://datasheet.octopart.com/CD4041UBPW-Texas-Instruments-datasheet-47642687.pdf?src-supplier=Newark; ComponentLink15Description: http://datasheet.octopart.com/CD4041UBPW-Texas-Instruments-datasheet-47642687.pdf?src-supplier=Newark; ComponentLink16URL: http://datasheet.octopart.com/CD4041UBPW-Texas-Instruments-datasheet-102487265.pdf?src-supplier=Newark; ComponentLink16Description: http://datasheet.octopart.com/CD4041UBPW-Texas-Instruments-datasheet-102487265.pdf?src-supplier=Newark; Category: buffer
U2 = LTC6993CS6-2#TRMPBF: Monostable Multivibrator Single-Element 0°C 70°C Automotive 6-Pin TSOT-23 T/R; Manufacturer: Analog Devices / Linear Technology; Propagation Delay: 11ns; Min Supply Voltage: 2.25V; Max Supply Voltage: 5.5V; Number of Timers/Counters: 1; High Level Output Current: -16mA; Low Level Output Current: 16mA; Turn-On Delay Time: 28ns; Schmitt Trigger Input: No; Supplier 1: Mouser; Supplier Part Number 1: 584-C6993CS6-2TRMPBF; Manufacturer Part Number: LTC6993CS6-2#TRMPBF; Stock 1: 27266; Pricing 1: 1 = 3.53000, 10 = 3.17000, 50 = 2.66000, 100 = 2.27000, 1000 = 1.77000, 10000 = 1.75000 (USD); Case/Package: SOT-23-6; Number of Pins: 6; Min Operating Temperature: 0°C; Max Operating Temperature: 70°C; Package Quantity: 1; Packaging: Tape and Reel; Number of Elements: 1; Logic Function: Multivibrator; Independent Circuits: 1; Series: LTC®6993; Radiation Hardening: No; REACH SVHC: No SVHC; RoHS Compliant: Yes; ComponentLink1URL: https://datasheet.ciiva.com/1885/29726-1885040.pdf?src-supplier=Digi-Key; ComponentLink1Description: https://datasheet.ciiva.com/1885/29726-1885040.pdf?src-supplier=Digi-Key; ComponentLink2URL: https://datasheet.ciiva.com/15095/getdatasheetpartid-365076-15095264.pdf?src-supplier=Verical; ComponentLink2Description: https://datasheet.ciiva.com/15095/getdatasheetpartid-365076-15095264.pdf?src-supplier=Verical; ComponentLink3URL: https://datasheet.ciiva.com/1885/29726-1885041.pdf?src-supplier=Digi-Key; ComponentLink3Description: https://datasheet.ciiva.com/1885/29726-1885041.pdf?src-supplier=Digi-Key; ComponentLink4URL: https://datasheet.ciiva.com/28646/1642036-28646037.pdf?src-supplier=Element14; ComponentLink4Description: https://datasheet.ciiva.com/28646/1642036-28646037.pdf?src-supplier=Element14; ComponentLink5URL: https://datasheet.ciiva.com/1142/1441932-1142200.pdf?src-supplier=Farnell; ComponentLink5Description: https://datasheet.ciiva.com/1142/1441932-1142200.pdf?src-supplier=Farnell; ComponentLink6URL: https://datasheet.ciiva.com/1142/1441932-1142201.pdf?src-supplier=Farnell; ComponentLink6Description: https://datasheet.ciiva.com/1142/1441932-1142201.pdf?src-supplier=Farnell; ComponentLink7URL: https://datasheet.ciiva.com/1139/1642036-1139629.pdf?src-supplier=Element14; ComponentLink7Description: https://datasheet.ciiva.com/1139/1642036-1139629.pdf?src-supplier=Element14; ComponentLink8URL: https://datasheet.ciiva.com/31419/1642036-31419357.pdf?src-supplier=Farnell; ComponentLink8Description: https://datasheet.ciiva.com/31419/1642036-31419357.pdf?src-supplier=Farnell; ComponentLink9URL: https://datasheet.ciiva.com/1885/29726-1885039.pdf?src-supplier=Digi-Key; ComponentLink9Description: https://datasheet.ciiva.com/1885/29726-1885039.pdf?src-supplier=Digi-Key; ComponentLink10URL: http://datasheet.octopart.com/LTC6993CS6-2%23TRMPBF-Linear-Technology-datasheet-10978048.pdf?src-supplier=TME; ComponentLink10Description: http://datasheet.octopart.com/LTC6993CS6-2%23TRMPBF-Linear-Technology-datasheet-10978048.pdf?src-supplier=TME; ComponentLink11URL: http://datasheet.octopart.com/LTC6993CS6-2%23TRMPBF-Linear-Technology-datasheet-58871654.pdf?src-supplier=Farnell; ComponentLink11Description: http://datasheet.octopart.com/LTC6993CS6-2%23TRMPBF-Linear-Technology-datasheet-58871654.pdf?src-supplier=Farnell; ComponentLink12URL: http://datasheet.octopart.com/LTC6993CS6-2%23TRMPBF-Linear-Technology-datasheet-10027958.pdf?src-supplier=Element14; ComponentLink12Description: http://datasheet.octopart.com/LTC6993CS6-2%23TRMPBF-Linear-Technology-datasheet-10027958.pdf?src-supplier=Element14; ComponentLink13URL: http://datasheet.octopart.com/LTC6993CS6-2%23TRMPBF-Linear-Technology-datasheet-10653347.pdf?src-supplier=Arrow+Electronics; ComponentLink13Description: http://datasheet.octopart.com/LTC6993CS6-2%23TRMPBF-Linear-Technology-datasheet-10653347.pdf?src-supplier=Arrow+Electronics; ComponentLink14URL: http://datasheet.octopart.com/LTC6993CS6-2%23TRMPBF-Linear-Technology-datasheet-10379881.pdf?src-supplier=Farnell; ComponentLink14Description: http://datasheet.octopart.com/LTC6993CS6-2%23TRMPBF-Linear-Technology-datasheet-10379881.pdf?src-supplier=Farnell; ComponentLink15URL: http://sigma.octopart.com/57691988/technical_drawing/Linear-Technology-LTC6993CS6-2%23TRMPBF.pdf?src-supplier=Linear+Technology; ComponentLink15Description: http://sigma.octopart.com/57691988/technical_drawing/Linear-Technology-LTC6993CS6-2%23TRMPBF.pdf?src-supplier=Linear+Technology
U3 = LTC2644CMS-L12#PBF: Digital To Analog Converter Dac, Dual, 12 Bit, Msop-12; Manufacturer: Analog Devices; Resolution: 12b; Number of Bits: 12; Number of D/A Converters: 2; Settling Time: 7.8us; Differential Output: No; Interface: PWM; Sampling Rate: 6.25KS/s; Supplier 1: Mouser; Supplier Part Number 1: 584-C2644CMS-L12PBF; Manufacturer Part Number: LTC2644CMS-L12#PBF; Stock 1: 642; Pricing 1: 1 = 6.21000, 10 = 5.61000, 50 = 4.90000, 100 = 4.20000, 1000 = 3.47000, 10000 = 3.47000 (USD); Case/Package: MSOP; Number of Pins: 12; Min Operating Temperature: 0°C; Max Operating Temperature: 70°C; Packaging: Rail/Tube; REACH SVHC: No SVHC; ComponentLink1URL: http://www.farnell.com/datasheets/2265704.pdf?src-supplier=Farnell; ComponentLink1Description: http://www.farnell.com/datasheets/2265704.pdf?src-supplier=Farnell; ComponentLink2URL: http://www.linear.com/docs/45234?src-supplier=Digi-Key; ComponentLink2Description: http://www.linear.com/docs/45234?src-supplier=Digi-Key; ComponentLink3URL: http://datasheet.octopart.com/LTC2644CMS-L12%23PBF-Linear-Technology-datasheet-32866045.pdf?src-supplier=Linear+Technology; ComponentLink3Description: http://datasheet.octopart.com/LTC2644CMS-L12%23PBF-Linear-Technology-datasheet-32866045.pdf?src-supplier=Linear+Technology; ComponentLink4URL: http://datasheet.octopart.com/LTC2644CMS-L12%23PBF-Linear-Technology-datasheet-81453756.pdf?src-supplier=Newark; ComponentLink4Description: http://datasheet.octopart.com/LTC2644CMS-L12%23PBF-Linear-Technology-datasheet-81453756.pdf?src-supplier=Newark; ComponentLink5URL: http://sigma.octopart.com/57695431/technical_drawing/Linear-Technology-LTC2644CMS-L12%23PBF.pdf?src-supplier=Linear+Technology; ComponentLink5Description: http://sigma.octopart.com/57695431/technical_drawing/Linear-Technology-LTC2644CMS-L12%23PBF.pdf?src-supplier=Linear+Technology
U4 = CD4041: Buffer 4-CH Inverting/Non-Inverting Push-Pull CMOS 14-Pin SOIC-14 Tube
U5 = ADP7104ARDZ-5.0-R7: Linear Voltage Regulator IC 1 Output 500mA 8-SOIC-EP; MF: Analog Devices; Availability: Unavailable; SnapEDA_Link: https://www.snapeda.com/parts/ADP7104ARDZ-5.0-R7/Analog%20Devices%20Inc./view-part/447566/?ref=snap; Price: None; MP: ADP7104ARDZ-5.0-R7; Arrow_Electronics-Purchase-URL: https://snapeda.com/shop?store=Arrow+Electronics&id=447566; Package: SOIC-8 Analog Devices; Value: *
U6 = TPS259631DDAR: 2.7V to 19 V 0.125A to 2A 89mOhm eFuse with Accurate Current Monitor and Fast Overvoltage Protection 8-Pin SOIC...; Manufacturer: Texas Instruments; Supplier 1: Mouser; Supplier Part Number 1: 595-TPS259631DDAR; Manufacturer Part Number: TPS259631DDAR; Stock 1: 3910; Pricing 1: 1 = 0.86000, 10 = 0.78200, 50 = 0.78200, 100 = 0.57000, 1000 = 0.37100, 10000 = 0.33700 (USD); ComponentLink1URL: https://octopart.com/click/track?ai=10049&ct=datasheets&sig=07573b3&at=physicalpart&sid=370&ppid=103943074&hlid=30203718&src-supplier=TI+store; ComponentLink1Description: https://octopart.com/click/track?ai=10049&ct=datasheets&sig=07573b3&at=physicalpart&sid=370&ppid=103943074&hlid=30203718&src-supplier=TI+store; ComponentLink2URL: http://sigma.octopart.com/104526336/technical_drawing/Texas-Instruments-TPS259631DDAR.pdf?src-supplier=TI+store; ComponentLink2Description: http://sigma.octopart.com/104526336/technical_drawing/Texas-Instruments-TPS259631DDAR.pdf?src-supplier=TI+store; ComponentLink3URL: http://datasheet.octopart.com/TPS259631DDAR-Texas-Instruments-datasheet-149164929.pdf?src-supplier=Upverter; ComponentLink3Description: http://datasheet.octopart.com/TPS259631DDAR-Texas-Instruments-datasheet-149164929.pdf?src-supplier=Upverter